# EAGLE design mag_servo (EAGLE 4.16)
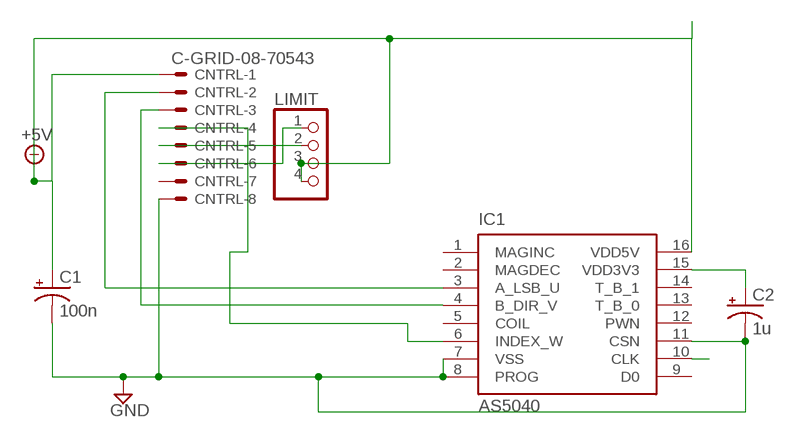
[diagram p0: schematic, sheet 1]

## Parts
C1  100n  CPOL-USE2.5-6  [E2,5-6]
C2  1u  CPOL-USE2.5-6  [E2,5-6]
CNTRL  C-GRID-08-70543  [70543-08]
IC1  AS5040  [SSOP16]
LIMIT  PINHD-1X4_2.54  [1X04]

## Nets
+5V: C1.+ CNTRL.1 IC1.16(VDD5V) LIMIT.3 LIMIT.4
GND: C1.- C2.- CNTRL.8 IC1.7(VSS) IC1.8(PROG) IC1.11(CSN)
N$1: CNTRL.2 IC1.3(A_LSB_U)
N$2: CNTRL.3 IC1.4(B_DIR_V)
N$3: CNTRL.4 IC1.6(INDEX_W)
N$4: C2.+ IC1.15(VDD3V3)
N$5: IC1.10(CLK)
N$7: CNTRL.5 LIMIT.2
N$8: CNTRL.6 LIMIT.1
Unconnected: CNTRL.7 IC1.1(MAGINC) IC1.2(MAGDEC) IC1.5(COIL) IC1.9(D0) IC1.12(PWN) IC1.13(T_B_0) IC1.14(T_B_1)

## Library data of the parts
C1 C2 = rcl:CPOL-US: POLARIZED CAPACITOR, American symbol
CNTRL = con-molex:C-GRID-08: CONNECTOR wire to board 2.54 mm (0.100") pitch header
IC1 = austriamicrosystems:AS5040: 10-BIT PROGRAMMABLE MAGNETIC ROTARY ENCODER Source: www.austriamicrosystems.com .. AS5040DataSheetRev12.pdf
LIMIT = pinhead-1:PINHD-1X4: PIN HEADER

## Board
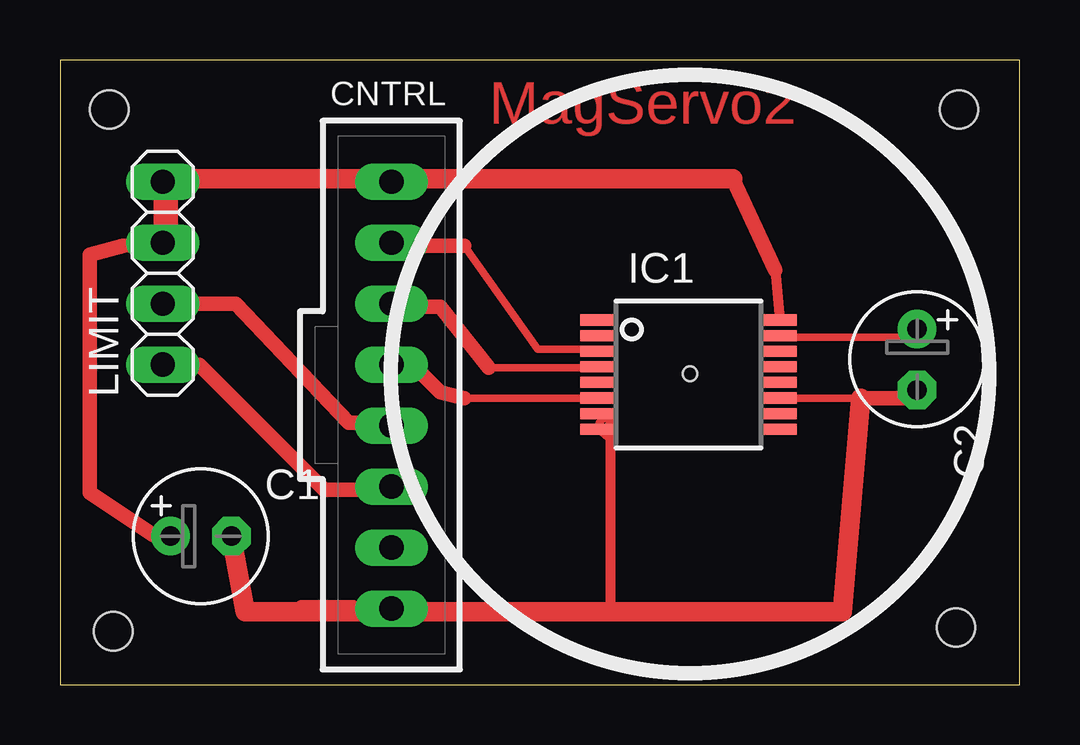
[diagram p1: board, top side]

Size 39.99 x 26.03 mm. Coordinates in mm from the lower left corner, seen from the top.
Outline: 0,0 39.99,0 39.99,26.03 0,26.03 0,0
Copper layers 1: Top 0.035mm
Design rules "default": minimum track width 10mil, minimum drill 24mil, track to track 8mil, track to pad 8mil, pad to pad 8mil, via to via 8mil, smd to smd 8mil, copper to edge 40mil, drill to drill 8mil, minimum pad ring 10mil, minimum via ring 8mil, stop-mask expansion 4mil, vias tented up to drill 0mil, thermal gap 10mil
Holes 1.6 mm at 2.06,23.97 2.22,2.22 37.33,2.38 37.46,23.97
Holes 0.6 mm at 26.25,12.95

### Footprints (pad centres in the part's own frame; a part is rotated, then mirrored left to right if it is on the bottom)
E2,5-6 = drill 0.813 pad 1.6 round: + -1.27,0 | drill 0.813 pad 1.6 octagon: - 1.27,0
70543-08 = drill 1.016 long: 1 -8.89,0; 2 -6.35,0; 3 -3.81,0; 4 -1.27,0; 5 1.27,0; 6 3.81,0; 7 6.35,0; 8 8.89,0
SSOP16 = smd 0.46 x 1.43: 1 -2.275,-3.795; 2 -1.625,-3.795; 3 -0.975,-3.795; 4 -0.325,-3.795; 5 0.325,-3.795; 6 0.975,-3.795; 7 1.625,-3.795; 8 2.275,-3.795; 9 2.275,3.795; 10 1.625,3.795; 11 0.975,3.795; 12 0.325,3.795; 13 -0.325,3.795; 14 -0.975,3.795; 15 -1.625,3.795; 16 -2.275,3.795
1X04 = drill 1.016 long: 1 -3.81,0; 2 -1.27,0; 3 1.27,0; 4 3.81,0

### Placement (x,y rotation side)
C1  5.87,6.19 0 top
C2  35.71,13.55 270 top
CNTRL  13.81,12.06 270 top
IC1  26.19,12.92 270 top
LIMIT  4.28,17.14 90 top

### Tracks (layer width: path | path; a pad name or v marks a point on that pad's centre or on a via)
+5V
  Top 0.254: LIMIT.3 4.41,19.05 | 4.41,20.32 LIMIT.4 5.68,21.08 | 3.9,6.22 C1.+ | 15.08,21.08 CNTRL.1 12.54,21.08
  Top 0.406: 29.81,17.27 IC1.16
  Top 0.61: 3.9,6.22 1.23,8 1.23,17.9 2.63,18.28 LIMIT.3 | 28.03,21.08 29.81,17.27
  Top 0.813: 15.08,21.08 28.03,21.08 | 5.68,21.08 12.54,21.08
  Top 1.016: 4.41,19.05 4.41,20.32
GND
  Top 0.254: 33.36,11.93 30.57,11.93 IC1.11 29.81,11.93 | 35.14,11.93 C2.- | IC1.7 22.95,11.17 22.44,10.92 IC1.8 22.95,10.15 | CNTRL.8 12.28,3.3 | 12.54,3.04 CNTRL.8 | CNTRL.8 14.82,3.04
  Top 0.305: 33.36,11.93 29.81,11.93
  Top 0.406: 12.28,3.3 10,3.3 | 22.95,3.04 22.95,10.15 22.95,11.17
  Top 0.61: 33.36,11.93 35.14,11.93
  Top 0.813: 12.54,3.04 7.71,3.04 C1.- | 33.36,11.93 32.6,3.04 22.95,3.04 14.82,3.04
N$1
  Top 0.254: 21.68,13.96 IC1.3 | CNTRL.2 15.08,18.28
  Top 0.305: 21.68,13.96 19.9,13.96 16.85,18.28
  Top 0.61: 15.08,18.28 16.85,18.28
N$2
  Top 0.254: 21.68,13.2 IC1.4 | CNTRL.3 14.57,15.74
  Top 0.305: 17.87,13.2 21.68,13.2
  Top 0.61: 17.87,13.2 15.84,15.74 14.57,15.74
N$3
  Top 0.254: 21.68,11.93 IC1.6 | CNTRL.4 14.82,13.2
  Top 0.305: 16.85,11.93 21.68,11.93
  Top 0.61: 16.85,11.93 15.84,12.19 14.82,13.2
N$4
  Top 0.254: IC1.15 30.57,14.47 | 35.65,14.47 C2.+
  Top 0.305: 30.57,14.47 35.65,14.47
N$7
  Top 0.254: LIMIT.2 3.14,15.74
  Top 0.61: CNTRL.5 12.54,10.92 12.03,10.92 7.33,15.87 LIMIT.2
N$8
  Top 0.406: LIMIT.1 5.8,13.33 | 13.55,8.12 13.68,8.25 CNTRL.6
  Top 0.61: 5.8,13.33 11.01,8.12 13.55,8.12

### Text on the board
Top: MagServo2